# Altium project Hall.PrjPCB
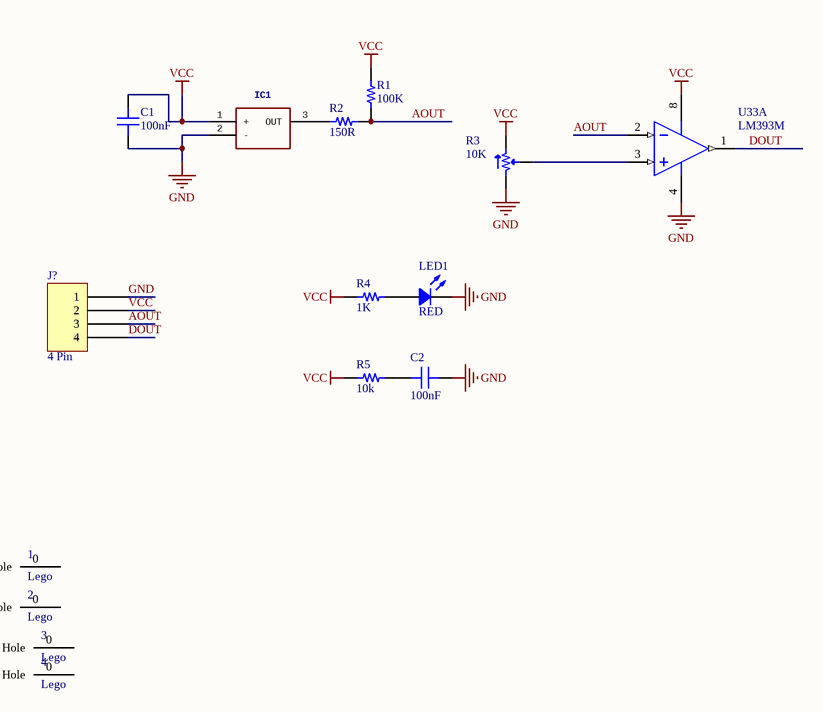
[diagram p0: Hall.SchDoc]
1 sheet, 15 parts. Net scope: global (net labels, ports and power ports of the same name join across sheets).
Board file: Hall.PcbDoc

## Sheet Hall.SchDoc
size A

### Parts
1  Lego  [Lego Hole]
2  Lego  [Lego Hole]
3  Lego  [Lego Hole]
4  Lego  [Lego Hole]
C1  100nF  [CAP 1206/3216]
C2  100nF  [CAP 1206/3216]
IC1  (no value)  [SSe49]
J?  4 Pin  [JST XH B4B-XH-A - RIGHT]
LED1  RED  [LED 0805/2012 RED]
R1  100K  [RES 1206/3216]
R2  150R  [RES 1206/3216]
R3  10K  [POT Panasonic EVM]
R4  1K  [RES 1206/3216]
R5  10k  [RES 1206/3216]
U33  LM393M  [M08A_N]  (part A of 2)

### Nets
GND: C1.1 C2.2 IC1.2(-) J?.1 LED1.2 R3.1 U33.4(GND)
VCC: C1.2 IC1.1(+) J?.2 R1.1 R3.3 R4.2 R5.2 U33.8(V+)
AOUT: J?.3 R1.2 R2.2 U33.2(INA-)
DOUT: J?.4 U33.1(OUTA)
NetC2_1: C2.1 R5.1
NetIC1_3: IC1.3(OUT) R2.1
NetLED1_1: LED1.1 R4.1
NetR3_2: R3.2 U33.3(INA+)

Not connected (* = marked no-connect by the designer): 1 0(Lego_Hole); 2 0(Lego_Hole); 3 0(Lego_Hole); 4 0(Lego_Hole)

### Library data of the parts
C1 C2 = Capacitor: SMT Capacitor; Value: 0.1uF
IC1 = SS49E-T3: Manufacturer_Name: Honeywell; GateName_1: G$1; Allied_Number: 70238630; SymbolName_1: SS49E-T3; LibraryName: SS49E-T3; DeviceSetName: SS49E-T3; Package: TO130P160X410X300-3P; Supplier_Name: RS; RS_Part_Number: 8749069; Manufacturer_Part_Number: SS49E-T3; Height: 1.6mm
LED1 = LED: Chip LED; Value: Green
R1 R2 R5 = Resistor: SMT Resistor; Value: 1K
R3 = Potentiometer: Value: 10k
R4 = Resistor: SMT Resistor; Value: 1K
U33 = LM393M: Low Power Low Offset Voltage Dual Comparator, 8-pin Narrow SOIC; Manufacturer: National Semiconductor; PackageTopMarking: NSZXTT*LM*393M; PowerWise: N; CompType: Amplifiers; High-Reliability: Y; DatasheetVersion: Aug-2002; PackageVersion: revM, May-2009; PackageReference: M08A; PackageDescription: SOIC Narrow, 4.9 x 3.9 x 1.45mm, 8 Lead, 1.27mm Pitch; PartNumber: LM393M; RoHS: N; PinCount: 8; Code_JEDEC: MS-012-AA; Code_IPC: SOIC127P600-8; ComponentLink1Description: Manufacturer URL; ComponentLink1URL: http://www.national.com/; ComponentLink2Description: LM393 Datasheet; ComponentLink2URL: http://www.national.com/ds/LM/LM393.pdf; ComponentLink3Description: LM393 Web Page; ComponentLink3URL: http://www.national.com/pf/LM/LM393.html; ComponentLink4Description: M08A Package Page; ComponentLink4URL: http://www.national.com/packaging/folders/m08a.html